# Altium schematic sheet icl7107pins.SchDoc
size 297 x 209 mm
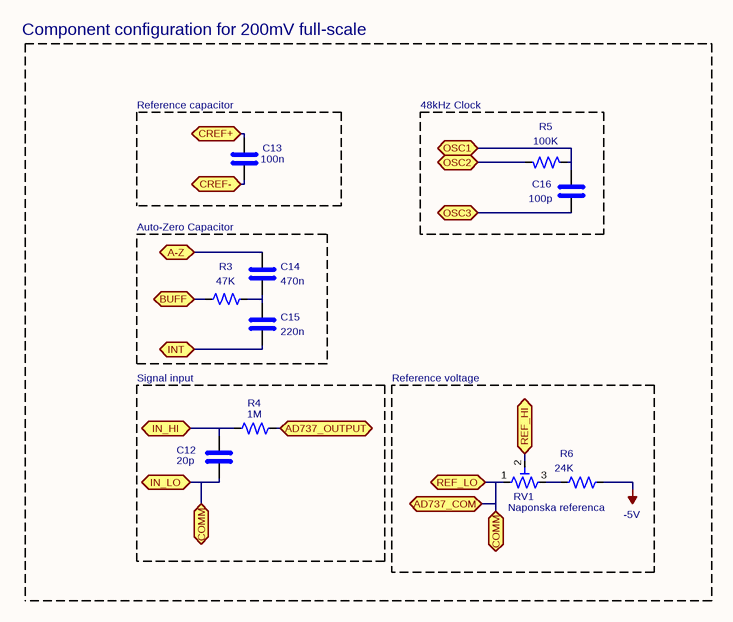
[diagram p0: icl7107pins.SchDoc]

## Parts
#PWR014  -5V
C12  20p  [C_1210_3225Metric]
C13  100n  [C_1210_3225Metric]
C14  470n  [C_1206_3216Metric]
C15  220n  [C_1206_3216Metric]
C16  100p  [C_1206_3216Metric]
R3  47K  [R_1206_3216Metric]
R4  1M  [R_1812_4532Metric]
R5  100K  [R_1206_3216Metric]
R6  24K  [R_1206_3216Metric]
RV1  Naponska referenca  [Potentiometer_Bourns_3266W_Vertical]

## Blocks framed on the sheet
Reference capacitor /: C13
48kHz Clock: C16 R5
Auto-Zero Capacitor /: C14 C15 R3
Signal input: C12 R4
Reference voltage: #PWR014 R6 RV1

## Ports
A-Z (bidir), AD737_COM (bidir), AD737_OUTPUT (bidir), BUFF (bidir), COMM (bidir), CREF+ (bidir), CREF- (bidir), IN_HI (bidir), IN_LO (bidir), INT (bidir), OSC1 (bidir), OSC2 (bidir), OSC3 (bidir), REF_HI (bidir), REF_LO (bidir)

## Nets
A-Z: C14.2 ; port A-Z
AD737_COM: C12.2 RV1.1 ; port AD737_COM, port REF_LO, port COMM, port IN_LO
AD737_OUTPUT: R4.2 ; port AD737_OUTPUT
BUFF: R3.1 ; port BUFF
CREF+: C13.1 ; port CREF+
CREF-: C13.2 ; port CREF-
IN_HI: C12.1 R4.1 ; port IN_HI
INT: C15.1 ; port INT
OSC1: C16.1 R5.1 ; port OSC1
OSC2: R5.2 ; port OSC2
OSC3: C16.2 ; port OSC3
REF_HI: RV1.2 ; port REF_HI
Net#PWR014_1: #PWR014.1(-5V) R6.1
NetC14_1: C14.1 C15.2 R3.2
NetR6_2: R6.2 RV1.3

## Notes on the sheet
- Component configuration for 200mV full-scale
- 1
- 2
- 3
- 4
- 5
- 6
- A
- B
- C
- Konfiguracija ICL7107 ADC konvertora
- D
- Title: Uređaj za merenje efektivne vrednosti AC napona
- File: icl7107pins.kicad_sch
- Sheet: /
- Srđan Milkić
- KiCad E.D.A.  kicad (5.1.4)-1
- Size: A4
- Date: 2024-01-19
- Rev: 2
- Id: 1/1

## Library data of the parts
C12-C16 = C
  C12: Value: 20p; Footprint: Capacitor_SMD:C_1210_3225Metric
  C13: Value: 100n; Footprint: Capacitor_SMD:C_1210_3225Metric
  C14: Value: 470n; Footprint: Capacitor_SMD:C_1206_3216Metric
  C15: Value: 220n; Footprint: Capacitor_SMD:C_1206_3216Metric
  C16: Value: 100p; Footprint: Capacitor_SMD:C_1206_3216Metric
R3-R6 = R_US
  R3: Value: 47K; Footprint: Resistor_SMD:R_1206_3216Metric
  R4: Value: 1M; Footprint: Resistor_SMD:R_1812_4532Metric
  R5: Value: 100K; Footprint: Resistor_SMD:R_1206_3216Metric
  R6: Value: 24K; Footprint: Resistor_SMD:R_1206_3216Metric
RV1 = R_Potentiometer_Trim_US: Value: Naponska referenca; Footprint: Potentiometer_THT:Potentiometer_Bourns_3266W_Vertical
#PWR014 = -5V: Value: -5V